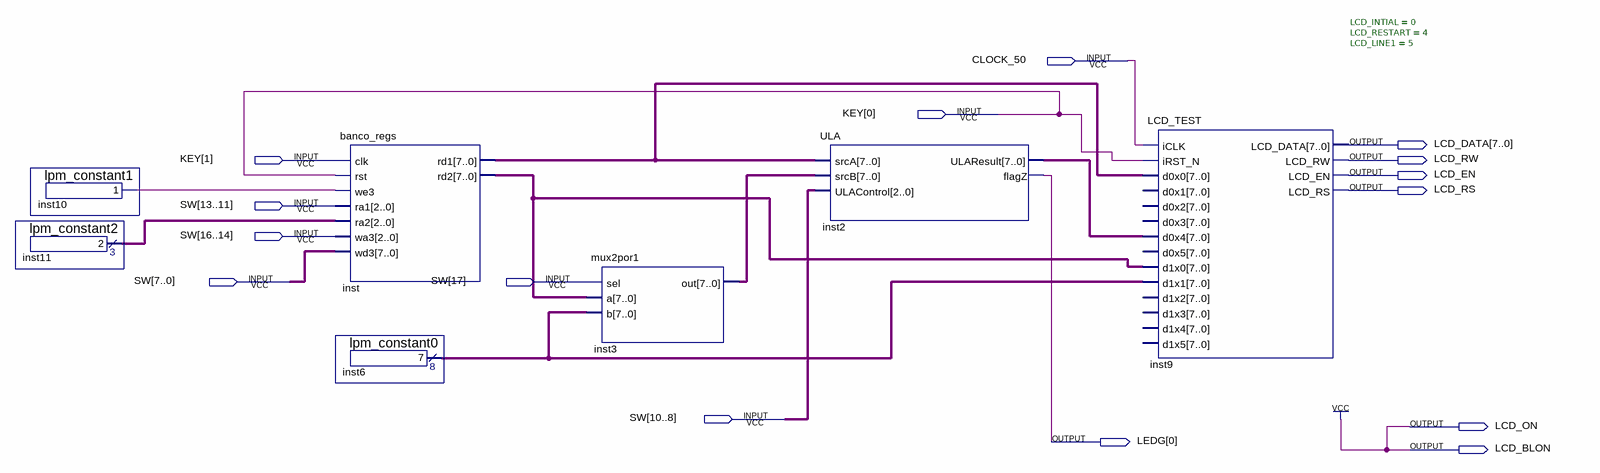
[diagram p0: schematic sheet]
// Quartus schematic block_diagram.bdf as structural Verilog: 7 symbols, 15 pins
module block_diagram (
  input  CLOCK_50,
  input  [1:0] KEY,
  input  [17:0] SW,
  output [7:0] LCD_DATA,
  output LCD_RW,
  output LCD_EN,
  output LCD_RS,
  output LCD_ON,
  output [0:0] LEDG,
  output LCD_BLON
);

  wire inst10_result;
  wire [2:0] inst11_result;
  wire [7:0] inst2_ularesult, inst3_out, inst6_result, inst_rd1, inst_rd2;

  lpm_constant1 inst10 (.result(inst10_result));
  lpm_constant2 inst11 (.result(inst11_result));
  banco_regs inst (
    .clk(KEY[1]), .rst(KEY[0]), .we3(inst10_result), .ra1(SW[13:11]), .ra2(inst11_result), .wa3(SW[16:14]),
    .wd3(SW[7:0]), .rd1(inst_rd1), .rd2(inst_rd2));
  lpm_constant0 inst6 (.result(inst6_result));
  mux2por1 inst3 (.sel(SW[17]), .a(inst_rd2), .b(inst6_result), .out(inst3_out));
  ULA inst2 (.srcA(inst_rd1), .srcB(inst3_out), .ULAControl(SW[10:8]), .ULAResult(inst2_ularesult), .flagZ(LEDG[0]));
  LCD_TEST #(.LCD_INTIAL(0), .LCD_RESTART(4), .LCD_LINE1(5)) inst9 (
    .iCLK(CLOCK_50), .iRST_N(KEY[0]), .d0x0(inst_rd1), .d0x4(inst2_ularesult), .d1x0(inst_rd2),
    .d1x1(inst6_result), .LCD_DATA(LCD_DATA), .LCD_RW(LCD_RW), .LCD_EN(LCD_EN), .LCD_RS(LCD_RS));  // open: d0x1, d0x2, d0x3, d0x5, d1x2, d1x3, d1x4, d1x5

  assign LCD_BLON = 1'b1;
  assign LCD_ON = 1'b1;
endmodule
